# Altium project LimeSDR_1v2.PrjPcb (part 1 of 3)
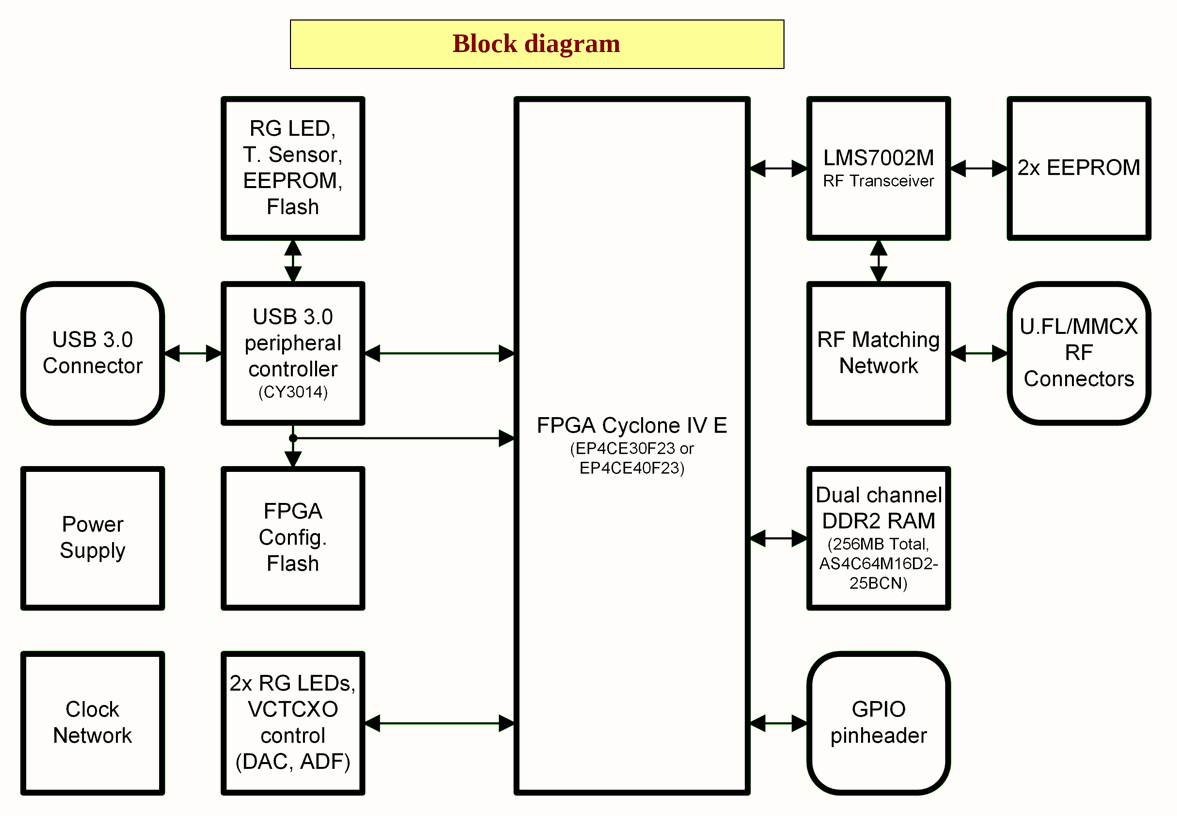
[diagram p0: 01_BlockDiagram.SchDoc]
8 sheets, 368 parts. Net scope: global (net labels, ports and power ports of the same name join across sheets).
Board file: LimeSDR_1v2.PcbDoc
Sheets:
  01_BlockDiagram.SchDoc
  02_PowerDiagram.SchDoc
  03_ClockDiagram.SchDoc
  05_LMS7002M_RF.SchDoc
  10_DDR2.SchDoc
  11_USB3_0_device.SchDoc
  12_USB3_0_power.SchDoc
  13_Clocks.SchDoc

## Sheet 01_BlockDiagram.SchDoc: Block diagram
size A4; Organization: Lime Microsystems; Address1: Surrey Tech Centre; Address2: Guildford GU2 7YG; Address3: Surrey; Address4: United Kingdom; Revision: v1.2; SheetNumber: 1; SheetTotal: 14

### Notes on the sheet
- Block diagram
- Project name:
- Title:
- Size:
- Date:
- A4
- Revision:
- Time:
- Sheet
- of
- File:

## Sheet 02_PowerDiagram.SchDoc: Power diagram
size A4; Organization: Lime Microsystems; Address1: Surrey Tech Centre; Address2: Guildford GU2 7YG; Address3: Surrey; Address4: United Kingdom; Revision: v1.2; SheetNumber: 2; SheetTotal: 14
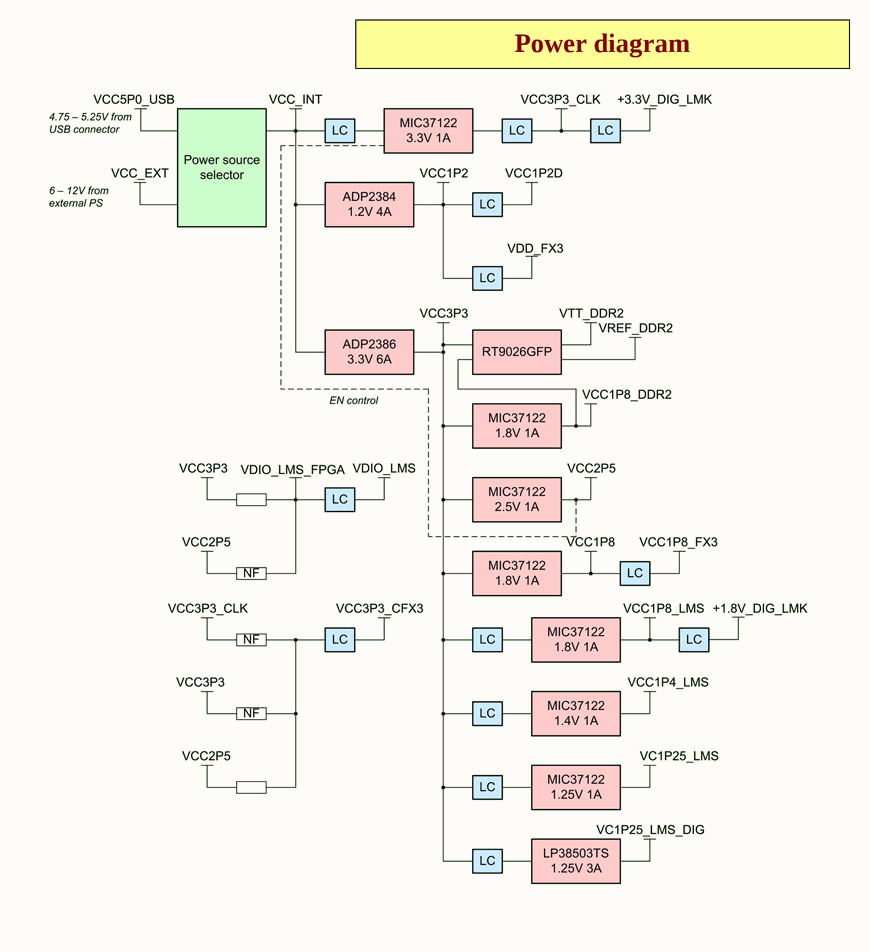
[diagram p1: 02_PowerDiagram.SchDoc]

### Notes on the sheet
- Power diagram
- Project name:
- Title:
- Size:
- Date:
- A4
- Revision:
- Time:
- Sheet
- of
- File:

## Sheet 03_ClockDiagram.SchDoc: Clock diagram
size A4; Organization: Lime Microsystems; Address1: Surrey Tech Centre; Address2: Guildford GU2 7YG; Address3: Surrey; Address4: United Kingdom; Revision: v1.2; SheetNumber: 3; SheetTotal: 14
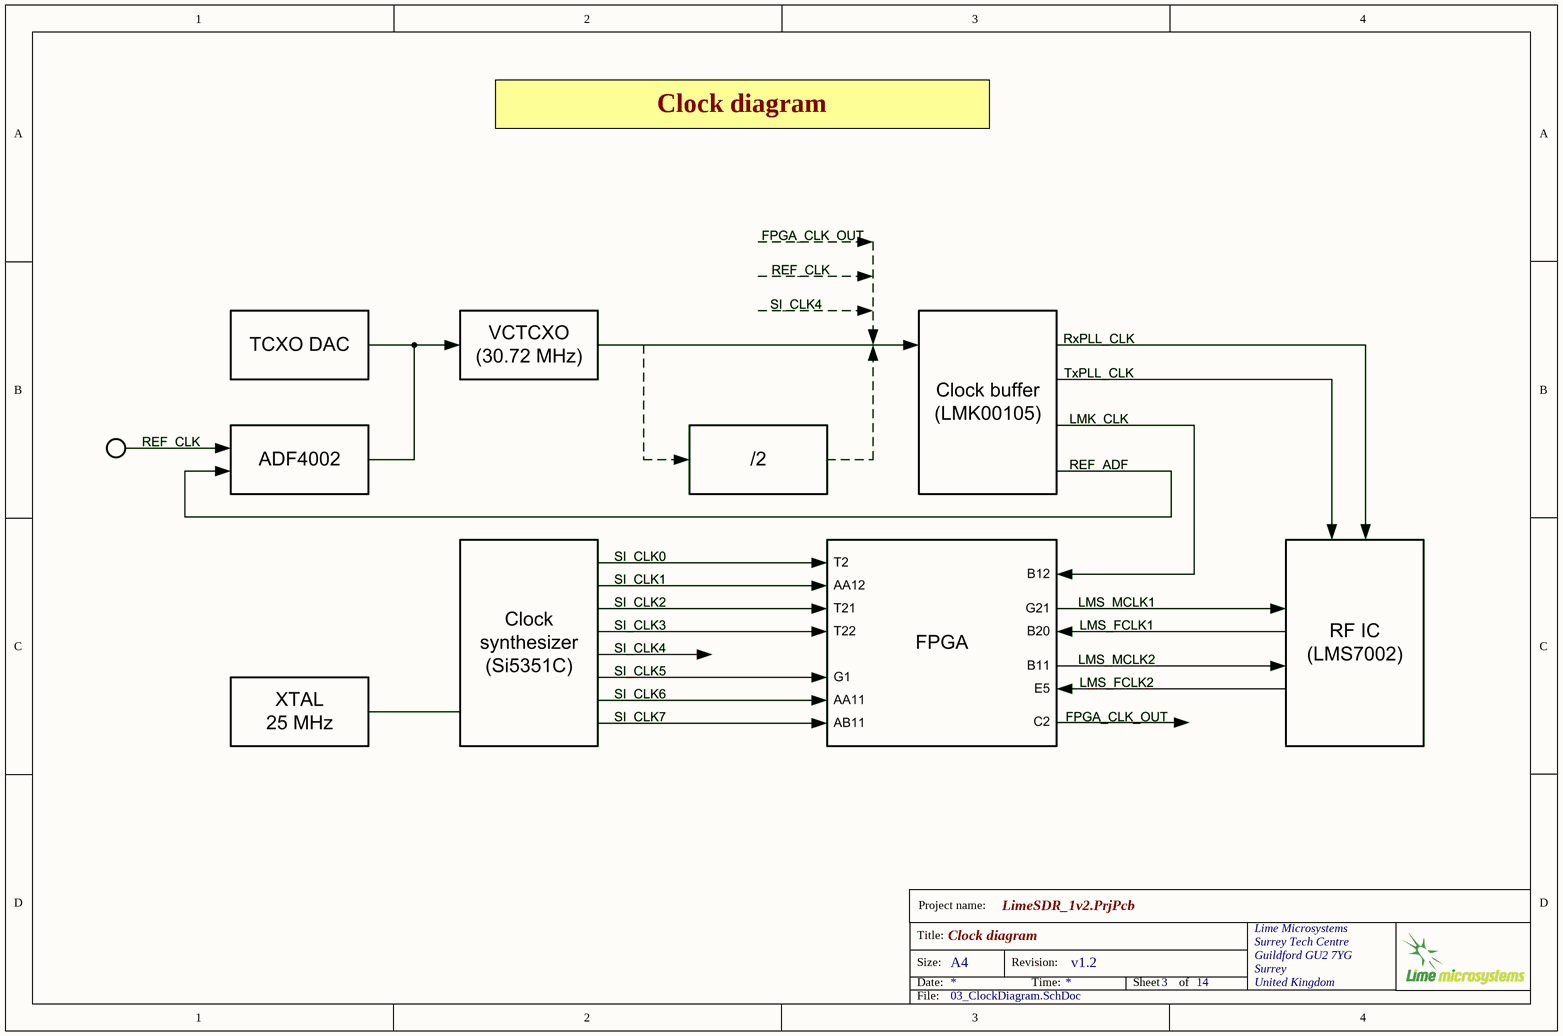
[diagram p2: 03_ClockDiagram.SchDoc]

### Notes on the sheet
- Clock diagram
- Project name:
- Title:
- Size:
- Date:
- A4
- Revision:
- Time:
- Sheet
- of
- File:

## Sheet 05_LMS7002M_RF.SchDoc: LMS7002M RF
size A3; Organization: Lime Microsystems; Address1: Surrey Tech Centre; Address2: Guildford GU2 7YG; Address3: Surrey; Address4: United Kingdom; Revision: v1.2; SheetNumber: 5; SheetTotal: 14
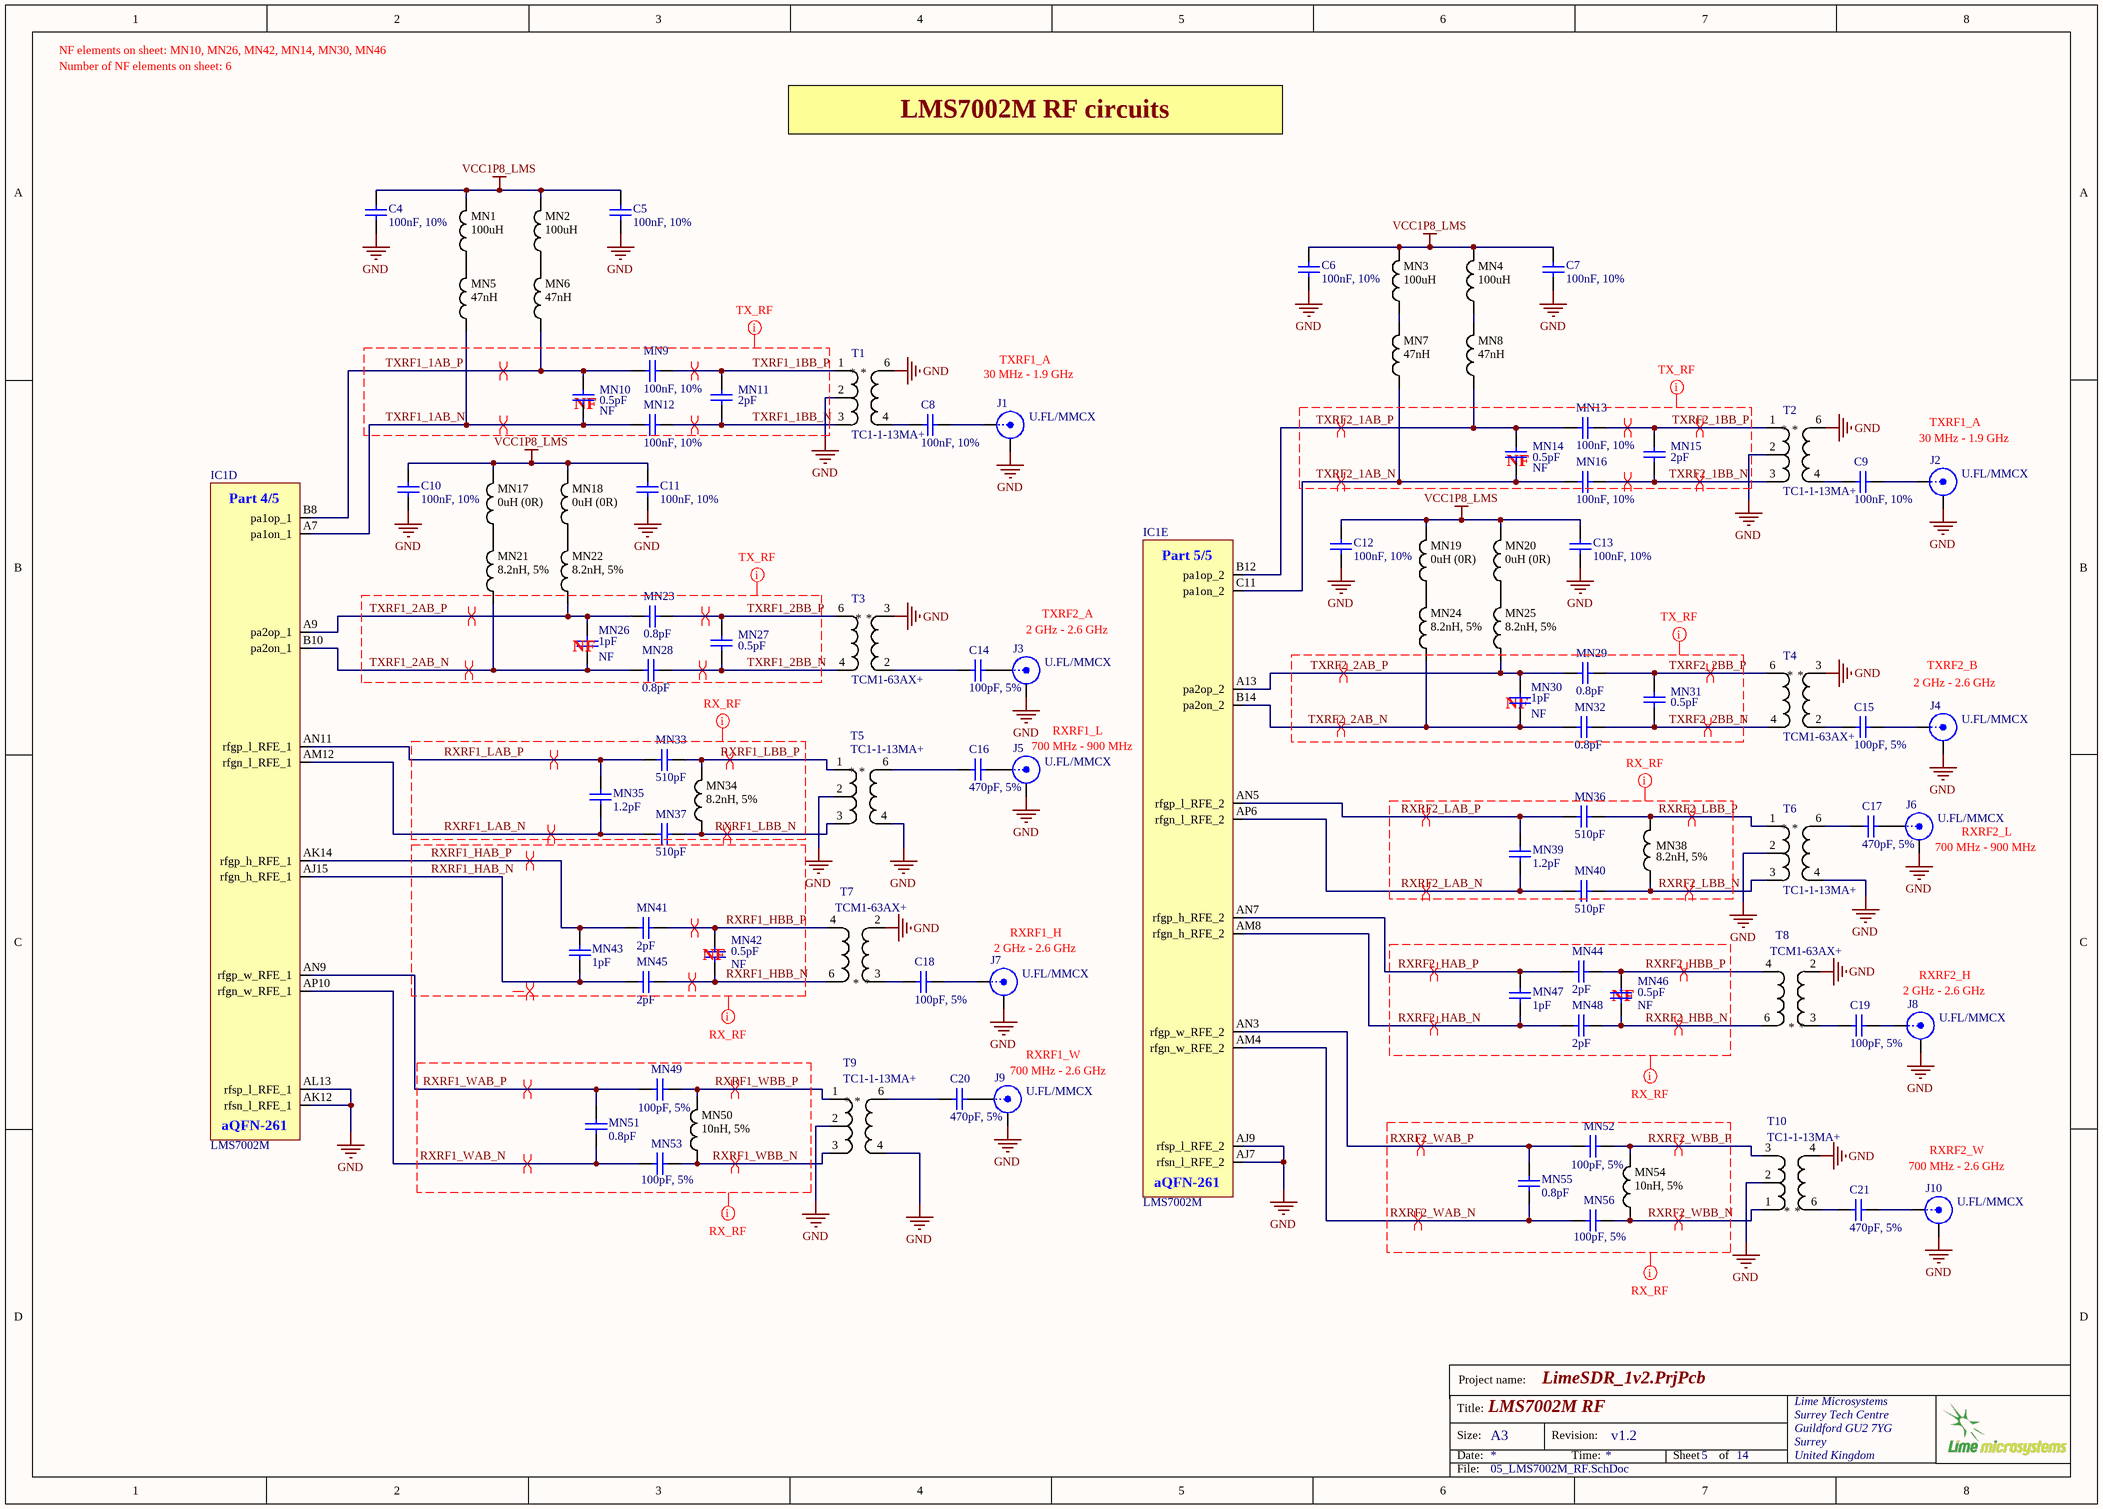
[diagram p3: 05_LMS7002M_RF.SchDoc]

### Parts
C4  100nF, 10%  [CAP0402]
C5  100nF, 10%  [CAP0402]
C6  100nF, 10%  [CAP0402]
C7  100nF, 10%  [CAP0402]
C8  100nF, 10%  [CAP0402]
C9  100nF, 10%  [CAP0402]
C10  100nF, 10%  [CAP0402]
C11  100nF, 10%  [CAP0402]
C12  100nF, 10%  [CAP0402]
C13  100nF, 10%  [CAP0402]
C14  100pF, 5%  [CAP0402]
C15  100pF, 5%  [CAP0402]
C16  470pF, 5%  [CAP0402]
C17  470pF, 5%  [CAP0402]
C18  100pF, 5%  [CAP0402]
C19  100pF, 5%  [CAP0402]
C20  470pF, 5%  [CAP0402]
C21  470pF, 5%  [CAP0402]
IC1  LMS7002M  [LMS7002M]  (parts D,E of 5)
J1  U.FL/MMCX  [MMCX_UFL_conn_u]
J2  U.FL/MMCX  [MMCX_UFL_conn_u]
J3  U.FL/MMCX  [MMCX_UFL_conn_u]
J4  U.FL/MMCX  [MMCX_UFL_conn_u]
J5  U.FL/MMCX  [MMCX_UFL_conn_u]
J6  U.FL/MMCX  [MMCX_UFL_conn_u]
J7  U.FL/MMCX  [MMCX_UFL_conn_u]
J8  U.FL/MMCX  [MMCX_UFL_conn_u]
J9  U.FL/MMCX  [MMCX_UFL_conn_u]
J10  U.FL/MMCX  [MMCX_UFL_conn_u]
MN1  100uH  [RES0805]
MN2  100uH  [RES0805]
MN3  100uH  [RES0805]
MN4  100uH  [RES0805]
MN5  47nH  [RES0402]
MN6  47nH  [RES0402]
MN7  47nH  [RES0402]
MN8  47nH  [RES0402]
MN9  100nF, 10%  [CAP0402]
MN10  0.5pF  Assembly Info: NF  [CAP0402]
MN11  2pF  [CAP0402]
MN12  100nF, 10%  [CAP0402]
MN13  100nF, 10%  [CAP0402]
MN14  0.5pF  Assembly Info: NF  [CAP0402]
MN15  2pF  [CAP0402]
MN16  100nF, 10%  [CAP0402]
MN17  0uH (0R)  [RES0805]
MN18  0uH (0R)  [RES0805]
MN19  0uH (0R)  [RES0805]
MN20  0uH (0R)  [RES0805]
MN21  8.2nH, 5%  [RES0402]
MN22  8.2nH, 5%  [RES0402]
MN23  0.8pF  [CAP0402]
MN24  8.2nH, 5%  [RES0402]
MN25  8.2nH, 5%  [RES0402]
MN26  1pF  Assembly Info: NF  [CAP0402]
MN27  0.5pF  [CAP0402]
MN28  0.8pF  [CAP0402]
MN29  0.8pF  [CAP0402]
MN30  1pF  Assembly Info: NF  [CAP0402]
MN31  0.5pF  [CAP0402]
MN32  0.8pF  [CAP0402]
MN33  510pF  [CAP0402]
MN34  8.2nH, 5%  [RES0402]
MN35  1.2pF  [CAP0402]
MN36  510pF  [CAP0402]
MN37  510pF  [CAP0402]
MN38  8.2nH, 5%  [RES0402]
MN39  1.2pF  [CAP0402]
MN40  510pF  [CAP0402]
MN41  2pF  [CAP0402]
MN42  0.5pF  Assembly Info: NF  [CAP0402]
MN43  1pF  [CAP0402]
MN44  2pF  [CAP0402]
MN45  2pF  [CAP0402]
MN46  0.5pF  Assembly Info: NF  [CAP0402]
MN47  1pF  [CAP0402]
MN48  2pF  [CAP0402]
MN49  100pF, 5%  [CAP0402]
MN50  10nH, 5%  [RES0402]
MN51  0.8pF  [CAP0402]
MN52  100pF, 5%  [CAP0402]
MN53  100pF, 5%  [CAP0402]
MN54  10nH, 5%  [RES0402]
MN55  0.8pF  [CAP0402]
MN56  100pF, 5%  [CAP0402]
T1  TC1-1-13MA+  [TC1-1-13MA+_v2]
T2  TC1-1-13MA+  [TC1-1-13MA+_v2]
T3  TCM1-63AX+  [TCM1-63AX+_v2]
T4  TCM1-63AX+  [TCM1-63AX+_v2]
T5  TC1-1-13MA+  [TC1-1-13MA+_v2]
T6  TC1-1-13MA+  [TC1-1-13MA+_v2]
T7  TCM1-63AX+  [TCM1-63AX+_v2]
T8  TCM1-63AX+  [TCM1-63AX+_v2]
T9  TC1-1-13MA+  [TC1-1-13MA+_v2]
T10  TC1-1-13MA+  [TC1-1-13MA+_v2]

### Nets
GND: C4.1 C5.1 C6.1 C7.1 C10.1 C11.1 C12.1 C13.1 IC1.AJ7(rfsn_l_RFE_2) IC1.AJ9(rfsp_l_RFE_2) IC1.AK12(rfsn_l_RFE_1) IC1.AL13(rfsp_l_RFE_1) J1.2(Y) J2.2(Y) J3.2(Y) J4.2(Y) J5.2(Y) J6.2(Y) J7.2(Y) J8.2(Y) J9.2(Y) J10.2(Y) T1.2 T1.6 T2.2 T2.6 T3.3 T4.3 T5.2 T5.4 T6.2 T6.4 T7.2 T8.2 T9.2 T9.4 T10.2 T10.4
VCC1P8_LMS: C4.2 C5.2 C6.2 C7.2 C10.2 C11.2 C12.2 C13.2 MN1.2 MN2.2 MN3.2 MN4.2 MN17.2 MN18.2 MN19.2 MN20.2
RXRF1_HAB_N: IC1.AJ15(rfgn_h_RFE_1) MN43.1 MN45.2
RXRF1_HAB_P: IC1.AK14(rfgp_h_RFE_1) MN41.2 MN43.2
RXRF1_HBB_N: MN42.1 MN45.1 T7.6
RXRF1_HBB_P: MN41.1 MN42.2 T7.4
RXRF1_LAB_N: IC1.AM12(rfgn_l_RFE_1) MN35.1 MN37.2
RXRF1_LAB_P: IC1.AN11(rfgp_l_RFE_1) MN33.2 MN35.2
RXRF1_LBB_N: MN34.1 MN37.1 T5.3
RXRF1_LBB_P: MN33.1 MN34.2 T5.1
RXRF1_WAB_N: IC1.AP10(rfgn_w_RFE_1) MN51.2 MN53.2
RXRF1_WAB_P: IC1.AN9(rfgp_w_RFE_1) MN49.2 MN51.1
RXRF1_WBB_N: MN50.1 MN53.1 T9.3
RXRF1_WBB_P: MN49.1 MN50.2 T9.1
RXRF2_HAB_N: IC1.AM8(rfgn_h_RFE_2) MN47.1 MN48.2
RXRF2_HAB_P: IC1.AN7(rfgp_h_RFE_2) MN44.2 MN47.2
RXRF2_HBB_N: MN46.1 MN48.1 T8.6
RXRF2_HBB_P: MN44.1 MN46.2 T8.4
RXRF2_LAB_N: IC1.AP6(rfgn_l_RFE_2) MN39.1 MN40.2
RXRF2_LAB_P: IC1.AN5(rfgp_l_RFE_2) MN36.2 MN39.2
RXRF2_LBB_N: MN38.1 MN40.1 T6.3
RXRF2_LBB_P: MN36.1 MN38.2 T6.1
RXRF2_WAB_N: IC1.AM4(rfgn_w_RFE_2) MN55.2 MN56.2
RXRF2_WAB_P: IC1.AN3(rfgp_w_RFE_2) MN52.2 MN55.1
RXRF2_WBB_N: MN54.1 MN56.1 T10.1
RXRF2_WBB_P: MN52.1 MN54.2 T10.3
TXRF1_1AB_N: IC1.A7(pa1on_1) MN5.1 MN10.1 MN12.1
TXRF1_1AB_P: IC1.B8(pa1op_1) MN6.1 MN9.2 MN10.2
TXRF1_1BB_N: MN11.1 MN12.2 T1.3
TXRF1_1BB_P: MN9.1 MN11.2 T1.1
TXRF1_2AB_N: IC1.B10(pa2on_1) MN21.1 MN26.2 MN28.2
TXRF1_2AB_P: IC1.A9(pa2op_1) MN22.1 MN23.2 MN26.1
TXRF1_2BB_N: MN27.1 MN28.1 T3.4
TXRF1_2BB_P: MN23.1 MN27.2 T3.6
TXRF2_1AB_N: IC1.C11(pa1on_2) MN7.1 MN14.1 MN16.1
TXRF2_1AB_P: IC1.B12(pa1op_2) MN8.1 MN13.2 MN14.2
TXRF2_1BB_N: MN15.1 MN16.2 T2.3
TXRF2_1BB_P: MN13.1 MN15.2 T2.1
TXRF2_2AB_N: IC1.B14(pa2on_2) MN24.1 MN30.2 MN32.2
TXRF2_2AB_P: IC1.A13(pa2op_2) MN25.1 MN29.2 MN30.1
TXRF2_2BB_N: MN31.1 MN32.1 T4.4
TXRF2_2BB_P: MN29.1 MN31.2 T4.6
NetC8_1: C8.1 J1.1(X)
NetC8_2: C8.2 T1.4
NetC9_1: C9.1 J2.1(X)
NetC9_2: C9.2 T2.4
NetC14_1: C14.1 J3.1(X)
NetC14_2: C14.2 T3.2
NetC15_1: C15.1 J4.1(X)
NetC15_2: C15.2 T4.2
NetC16_1: C16.1 J5.1(X)
NetC16_2: C16.2 T5.6
NetC17_1: C17.1 J6.1(X)
NetC17_2: C17.2 T6.6
NetC18_1: C18.1 J7.1(X)
NetC18_2: C18.2 T7.3
NetC19_1: C19.1 J8.1(X)
NetC19_2: C19.2 T8.3
NetC20_1: C20.1 J9.1(X)
NetC20_2: C20.2 T9.6
NetC21_1: C21.1 J10.1(X)
NetC21_2: C21.2 T10.6
NetMN1_1: MN1.1 MN5.2
NetMN2_1: MN2.1 MN6.2
NetMN3_1: MN3.1 MN7.2
NetMN4_1: MN4.1 MN8.2
NetMN17_1: MN17.1 MN21.2
NetMN18_1: MN18.1 MN22.2
NetMN19_1: MN19.1 MN24.2
NetMN20_1: MN20.1 MN25.2

### Layout directives
differential pair: RXRF1_HAB_N, RXRF1_HAB_P, RXRF1_HBB_N, RXRF1_HBB_P, RXRF1_LAB_N, RXRF1_LAB_P, RXRF1_LBB_N, RXRF1_LBB_P, RXRF1_WAB_N, RXRF1_WAB_P, RXRF1_WBB_N, RXRF1_WBB_P, RXRF2_HAB_N, RXRF2_HAB_P, RXRF2_HBB_N, RXRF2_HBB_P, RXRF2_LAB_N, RXRF2_LAB_P, RXRF2_LBB_N, RXRF2_LBB_P, RXRF2_WAB_N, RXRF2_WAB_P, RXRF2_WBB_N, RXRF2_WBB_P, TXRF1_1AB_N, TXRF1_1AB_P, TXRF1_1BB_N, TXRF1_1BB_P, TXRF1_2AB_N, TXRF1_2AB_P, TXRF1_2BB_N, TXRF1_2BB_P, TXRF2_1AB_N, TXRF2_1AB_P, TXRF2_1BB_N, TXRF2_1BB_P, TXRF2_2AB_N, TXRF2_2AB_P, TXRF2_2BB_N, TXRF2_2BB_P
net class TX_RF: TXRF1_1AB_N, TXRF1_1AB_P, TXRF1_1BB_N, TXRF1_1BB_P, TXRF1_2AB_N, TXRF1_2AB_P, TXRF1_2BB_N, TXRF1_2BB_P, TXRF2_1AB_N, TXRF2_1AB_P, TXRF2_1BB_N, TXRF2_1BB_P, TXRF2_2AB_N, TXRF2_2AB_P, TXRF2_2BB_N, TXRF2_2BB_P
net class RX_RF: RXRF1_HAB_N, RXRF1_HAB_P, RXRF1_HBB_N, RXRF1_HBB_P, RXRF1_LAB_N, RXRF1_LAB_P, RXRF1_LBB_N, RXRF1_LBB_P, RXRF1_WAB_N, RXRF1_WAB_P, RXRF1_WBB_N, RXRF1_WBB_P, RXRF2_HAB_N, RXRF2_HAB_P, RXRF2_HBB_N, RXRF2_HBB_P, RXRF2_LAB_N, RXRF2_LAB_P, RXRF2_LBB_N, RXRF2_LBB_P, RXRF2_WAB_N, RXRF2_WAB_P, RXRF2_WBB_N, RXRF2_WBB_P

### Notes on the sheet
- Number of NF elements on sheet: 6
- NF elements on sheet: MN10, MN26, MN42, MN14, MN30, MN46
- LMS7002M RF circuits
- 30 MHz - 1.9 GHz
- TXRF1_A
- (near MN10) NF
- (near J2) 30 MHz - 1.9 GHz
- (near MN14) NF
- (near MN26) NF
- 2 GHz - 2.6 GHz
- TXRF2_A
- (near MN30) NF
- TXRF2_B
- (near J5) 700 MHz - 900 MHz
- RXRF1_L
- (near J6) 700 MHz - 900 MHz
- (near J6) RXRF2_L
- (near MN42) NF
- (near J7) 2 GHz - 2.6 GHz
- (near J7) RXRF1_H
- RXRF2_H
- RXRF1_W
- (near MN46) NF
- (near J8) 2 GHz - 2.6 GHz
- (near J9) 700 MHz - 2.6 GHz
- 700 MHz - 2.6 GHz
- (near J10) RXRF2_W
- Project name:
- Title:
- Size:
- Date:
- A3
- Revision:
- Time:
- Sheet
- of
- File:
- (in symbol LMS7002M, part D) Part 4/5; aQFN-261
- (in symbol LMS7002M, part E) Part 5/5; aQFN-261

### Library data of the parts
C4-C13 = Cap_0402: Manufacturer: Murata Electronics; Manufacturer Part Number: GRM155R71C104KA88D; Part Description: 0.10µF ±10% 16V X7R Ceramic Capacitor -55°C ~ 125°C Surface Mount, MLCC 0402 (1005 Metric) 0.039" L x 0.020" W (1.00mm x 0.50mm); Voltage Rating DC: 16 V; Type: General Purpose MLCC; Capacitance: 0.1 uF; Case Length: 1 mm; Dielectric: X7R; Case Height: 0.5 mm; Temperature Coefficient / Code: +/- 15 %; Value: 100nF, 10%; Supplier 1: Mouser; Supplier Part Number 1: 81-GRM155R71C104KA88; Case Code - in: 0402; RoHS: RoHS Compliant; Operating Temperature Range: - 55 C to + 125 C; Series: GRM; Termination Style: SMD/SMT; Tolerance: 10 %; Package / Case: 0402 (1005 metric); Maximum Operating Temperature: + 125 C; Case Code - mm: 1005; Minimum Operating Temperature: - 55 C; Product Category: Low & Medium Capacitance SMD Ceramic Chip Capacitors; Packaging: Reel; Product: General Type MLCCs; Category: Multilayer Ceramic Capacitors MLCC - SMD/SMT; Brand: Murata Electronics; Case Width: 0.5 mm; RoHS - Mouser: Y; Standard Pack Qty: 10000; Minimum Order Quantity: 1; Reeling: True; Manufacturer Part Number 1: GRM155R71C104KA88D
C14 C15 C18 C19 MN49 MN52 MN53 MN56 = Cap_0402: Manufacturer Part Number 1: CC0402JRNPO9BN101; Manufacturer: Yageo; Part Description: 100pF ±5% 50V C0G, NP0 Ceramic Capacitor -55°C ~ 125°C Surface Mount, MLCC 0402 (1005 Metric) 0.039" L x 0.020" W (1.00mm x 0.50mm); Temperature Coefficient: C0G, NP0; Voltage - Rated: 50V; Value: 100pF, 5%; Capacitance: 100pF; Thickness (Max): 0.022" (0.55mm); Size / Dimension: 0.039" L x 0.020" W (1.00mm x 0.50mm); Tolerance: ±5%; RoHS: RoHS Compliant; Ratings: -; Package / Case: 0402 (1005 Metric); Mounting Type: Surface Mount, MLCC; Height - Seated (Max): -; Features: -; Lead Spacing: -; Operating Temperature: -55°C ~ 125°C; Packaging: Cut Tape (CT); Applications: General Purpose; Lead Style: -; Supplier 1: Digi-Key; Category: Capacitors; Supplier Part Number 1: 311-1024-1-ND
C16 C17 C20 C21 = Cap_0402: Manufacturer Part Number: C1005C0G1H471J050BA; Manufacturer: TDK Corporation; Part Description: 470pF ±5% 50V C0G, NP0 Ceramic Capacitor -55°C ~ 125°C Surface Mount, MLCC 0402 (1005 Metric) 0.039" L x 0.020" W (1.00mm x 0.50mm); Temperature Coefficient: C0G, NP0; Voltage - Rated: 50V; Value: 470pF, 5%; Supplier 1: Digi-Key; Supplier Part Number 1: 445-2656-6-ND; Ratings: -; Package / Case: 0402 (1005 Metric); Capacitance: 470pF; Packaging: Digi-Reel®; RoHS: RoHS Compliant; Tolerance: ±5%; Lead Style: -; Thickness (Max): 0.022" (0.55mm); Size / Dimension: 0.039" L x 0.020" W (1.00mm x 0.50mm); Lead Spacing: -; Operating Temperature: -55°C ~ 125°C; Height - Seated (Max): -; Applications: General Purpose; Mounting Type: Surface Mount, MLCC; Category: Capacitors; Features: -
IC1 = LMS7002M: Part Description: IC FPRF Transceiver LMS7002M; 261 pin aQFN; Manufacturer: Lime Microsystems; Manufacturer Part Number 1: LMS7002M; Supplier 1: Lime Microsystems; Supplier Part Number 1: LMS7002M
J1-J10 = RF_IF_connector: CONN UMC RCPT STR 50 OHM SMD; Manufacturer: Molex, LLC; Manufacturer Part Number 1: 0734120110; Body Finish: Nickel; Body Material: Phosphor Bronze; Center Contact Material: Brass; Center Contact Plating: Gold; Connector Style: Ultra Miniature Coaxial; Connector Type: Jack, Male Pin; Contact Termination: Solder; Dielectric Material: Liquid Crystal Polymer (LCP); Frequency - Max: 6GHz; Impedance: 50 Ohm; Voltage Rating: 60V; Cable Group: -; Category: Connectors, Interconnects; Fastening Type: Snap-On; Features: -; Housing Color: Silver; Ingress Protection: -; Mounting Type: Surface Mount; Operating Temperature: -40°C ~ 90°C; Packaging: Cut Tape (CT); RoHS: RoHS Compliant; Shield Termination: Solder; Supplier 1: Digi-Key; Supplier Part Number 1: WM5587CT-ND; Part Description: CONN UMC RCPT STR 50 OHM SMD
MN1-MN4 = Inductor_0603: Manufacturer: TDK Corporation; Manufacturer Part Number: MLF2012C101KT000; Part Description: FIXED IND 100UH 2MA 3.1 OHM SMD; Q @ Freq: 25 @ 1MHz; Shielding: Shielded; Current Rating: 2mA; Frequency - Self Resonant: 7MHz; Frequency - Test: 1MHz; Material - Core: Ferrite; Tolerance: ±10%; Inductance: 100µH; DC Resistance (DCR): 3.1 Ohm Max; Value: 100uH; Supplier 1: Digi-Key; Supplier Part Number 1: 445-1071-1-ND; Supplier Device Package: 0805 (2012 Metric); Size / Dimension: 0.079" L x 0.049" W (2.00mm x 1.25mm); Operating Temperature: -40°C ~ 85°C; Packaging: Cut Tape (CT); RoHS: RoHS Compliant; Current - Saturation: -; Height - Seated (Max): 0.057" (1.45mm); Package / Case: 0805 (2012 Metric); Mounting Type: Surface Mount; Type: Multilayer; Category: Inductors, Coils, Chokes
MN5-MN8 = Inductor_0603: Manufacturer: COILCRAFT; Manufacturer Part Number: 0402HP-47NXJLU; Part Description: INDUCTOR, RF, 47NH, 5%, 2.4GHZ, SMD; Product Range:0402HP Series; Inductance:47nH; Inductance Tolerance:± 5%; High Frequency Inductor Case:0402 [1005 Metric]; Self Resonant Frequency Min:2.4GHz; DC Resistance Max:0.58ohm; DC Current Rating:420mA; SVHC: No SVHC (15-Jun-2015); Inductance Tolerance: ± 5%; High Frequency Inductor Case: 0402 [1005 Metric]; Inductor Case Style: 0402 [1005 Metric]<!--FANDB--><div class="features-and-benefits-container"></div>; Inductance: 47; DC Resistance Max: 0.58; Self Resonant Frequency Min: 2.4; Product Range: 0402; DC Current Rating: 420; Inductor Construction: Wirewound; Supplier 1: Farnell; Supplier Part Number 1: 2285856; Packaging: Cut Tape; RoHS: Y-EX; value: 47nH
MN9 MN12 MN13 MN16 = Cap_0402: Manufacturer: Murata Electronics; Manufacturer Part Number: GRM155R71C104KA88D; Part Description: 0.10µF ±10% 16V X7R Ceramic Capacitor -55°C ~ 125°C Surface Mount, MLCC 0402 (1005 Metric) 0.039" L x 0.020" W (1.00mm x 0.50mm); Voltage Rating DC: 16 V; Capacitance: 0.1 uF; Case Length: 1 mm; Dielectric: X7R; Case Height: 0.5 mm; Temperature Coefficient / Code: +/- 15 %; Value: 100nF, 10%; Supplier 1: Mouser; Supplier Part Number 1: 81-GRM155R71C104KA88; Case Code - in: 0402; RoHS: RoHS Compliant; Operating Temperature Range: - 55 C to + 125 C; Series: GRM; Termination Style: SMD/SMT; Tolerance: 10 %; Package / Case: 0402 (1005 metric); Type: General Purpose MLCC; Maximum Operating Temperature: + 125 C; Case Code - mm: 1005; Minimum Operating Temperature: - 55 C; Product Category: Low & Medium Capacitance SMD Ceramic Chip Capacitors; Packaging: Reel; Product: General Type MLCCs; Category: Multilayer Ceramic Capacitors MLCC - SMD/SMT; Brand: Murata Electronics; Case Width: 0.5 mm; RoHS - Mouser: Y; Standard Pack Qty: 10000; Minimum Order Quantity: 1; Reeling: True; Manufacturer Part Number 1: GRM155R71C104KA88D
MN10 MN14 MN27 MN31 MN42 MN46 = Cap_0402: Manufacturer: Yageo; Manufacturer Part Number 1: CC0402CRNPO9BNR50; Part Description: 0.50pF ±0.25pF 50V C0G, NP0 Ceramic Capacitor -55°C ~ 125°C Surface Mount, MLCC 0402 (1005 Metric) 0.039" L x 0.020" W (1.00mm x 0.50mm); Capacitance: 0.50pF; Voltage - Rated: 50V; Temperature Coefficient: C0G, NP0; Tolerance: ±0.25pF; Value: 0.5pF; Supplier 1: Digi-Key; Supplier Part Number 1: 311-1001-1-ND; RoHS: RoHS Compliant; Thickness (Max): 0.022" (0.55mm); Features: -; Height - Seated (Max): -; Lead Spacing: -; Applications: General Purpose; Packaging: Cut Tape (CT); Ratings: -; Size / Dimension: 0.039" L x 0.020" W (1.00mm x 0.50mm); Lead Style: -; Mounting Type: Surface Mount, MLCC; Operating Temperature: -55°C ~ 125°C; Package / Case: 0402 (1005 Metric); Category: Capacitors
MN11 MN15 MN41 MN44 MN45 MN48 = Cap_0402: Manufacturer Part Number: 04025U2R0BAT2A; Manufacturer: AVX; Part Description: 2pF ±0.1pF 50V C0G, NP0 Ceramic Capacitor -55°C ~ 125°C Surface Mount, MLCC 0402 (1005 Metric) 0.039" L x 0.020" W (1.00mm x 0.50mm); Product Range: U Series; Voltage Rating: 50; SVHC: No SVHC (17-Dec-2014); Capacitance Tolerance: ± 0.1; Ceramic Capacitor Case: 0402 [1005 Metric]; Capacitance: 2; Dielectric Characteristic: C0G / NP0; Value: 2pF; Supplier 1: Farnell; Supplier Part Number 1: 2332536; Operating Temperature Max: 125; RoHS: YES; Operating Temperature Min: -55; Capacitance Tolerance ±: ± 0.1; Packaging: Cut Tape; MSL: MSL 1 - Unlimited
MN17-MN20 = Inductor_0603: Manufacturer: BOURNS; Manufacturer Part Number 1: CR0805-J/-000ELF; Part Description: RES SMD 0.0 OHM JUMPER 1/8W 0805; Value: 0uH (0R); Supplier 1: Farnell; Supplier Part Number 1: 2008388; RoHS: YES
MN21 MN22 MN24 MN25 MN34 MN38 = Inductor_0603: Manufacturer: COILCRAFT; Manufacturer Part Number 1: 0402HP-8N2XJLU; Part Description: INDUCTOR, RF, 8.2NH, 5%, 5.4GHZ, SMD; Product Range:0402HP Series; Inductance:8.2nH; Inductance Tolerance:± 5%; High Frequency Inductor Case:0402 [1005 Metric]; Self Resonant Frequency Min:5.4GHz; DC Resistance Max:0.065ohm; DC Current Rating:1.5A; Inductor Construction: Wirewound; DC Current Rating: 1.5; Inductor Case Style: 0402 [1005 Metric]<!--FANDB--><div class="features-and-benefits-container"></div>; Self Resonant Frequency Min: 5.4; DC Resistance Max: 0.065; High Frequency Inductor Case: 0402 [1005 Metric]; SVHC: No SVHC (16-Jun-2014); Inductance: 8.2; Supplier 1: Farnell; Supplier Part Number 1: 2285826; Packaging: Cut Tape; Product Range: COILCRAFT - 0402; Inductance Tolerance: ± 5%; RoHS: Y-EX; Value: 8.2nH, 5%
MN23 MN28 MN29 MN32 MN51 MN55 = Cap_0402: Manufacturer: Murata Electronics North America; Manufacturer Part Number: GRM1555C1HR80BA01D; Part Description: 0.80pF ±0.1pF 50V C0G, NP0 Ceramic Capacitor -55°C ~ 125°C Surface Mount, MLCC 0402 (1005 Metric) 0.039" L x 0.020" W (1.00mm x 0.50mm); Temperature Coefficient: C0G, NP0; Capacitance: 0.80pF; Voltage - Rated: 50V; Tolerance: ±0.1pF; Value: 0.8pF; Applications: General Purpose; Operating Temperature: -55°C ~ 125°C; Size / Dimension: 0.039" L x 0.020" W (1.00mm x 0.50mm); Features: -; Supplier 1: Digi-Key; Height - Seated (Max): -; Category: Capacitors; Package / Case: 0402 (1005 Metric); Mounting Type: Surface Mount, MLCC; Lead Spacing: -; Thickness (Max): 0.022" (0.55mm); RoHS: RoHS Compliant; Supplier Part Number 1: 490-6269-1-ND; Packaging: Cut Tape (CT); Ratings: -; Lead Style: -
MN26 MN30 MN43 MN47 = Cap_0402: Manufacturer: TDK Corporation; Manufacturer Part Number 1: C1005C0G1H010B050BA; Part Description: 1pF ±0.1pF 50V C0G, NP0 Ceramic Capacitor -55°C ~ 125°C Surface Mount, MLCC 0402 (1005 Metric) 0.039" L x 0.020" W (1.00mm x 0.50mm); Voltage - Rated: 50V; Temperature Coefficient: C0G, NP0; Tolerance: ±0.1pF; Value: 1pF; Supplier 1: Digi-Key; Supplier Part Number 1: 445-4854-6-ND; Size / Dimension: 0.039" L x 0.020" W (1.00mm x 0.50mm); Lead Spacing: -; Operating Temperature: -55°C ~ 125°C; Thickness (Max): 0.022" (0.55mm); Package / Case: 0402 (1005 Metric); Features: -; Lead Style: -; Applications: General Purpose; Height - Seated (Max): -; Capacitance: 1pF; RoHS: RoHS Compliant; Mounting Type: Surface Mount, MLCC; Packaging: Digi-Reel®; Ratings: -; Category: Capacitors
MN33 MN36 MN37 MN40 = Cap_0402: Manufacturer: Murata Electronics North America; Manufacturer Part Number: GRM1555C1H511JA01D; Part Description: 510pF ±5% 50V C0G, NP0 Ceramic Capacitor -55°C ~ 125°C Surface Mount, MLCC 0402 (1005 Metric) 0.039" L x 0.020" W (1.00mm x 0.50mm); Voltage - Rated: 50V; Temperature Coefficient: C0G, NP0; Tolerance: ±5%; Value: 510pF; Supplier 1: Digi-Key; Supplier Part Number 1: 490-3237-1-ND; Height - Seated (Max): -; Features: -; Size / Dimension: 0.039" L x 0.020" W (1.00mm x 0.50mm); Applications: General Purpose; Lead Spacing: -; Package / Case: 0402 (1005 Metric); Ratings: -; Thickness (Max): 0.022" (0.55mm); Lead Style: -; Operating Temperature: -55°C ~ 125°C; Mounting Type: Surface Mount, MLCC; Capacitance: 510pF; Category: Capacitors; RoHS: RoHS Compliant; Packaging: Cut Tape (CT)
MN35 MN39 = Cap_0402: Manufacturer: Murata Electronics North America; Manufacturer Part Number: GRM1555C1H1R2CA01D; Part Description: 1.2pF ±0.25pF 50V C0G, NP0 Ceramic Capacitor -55°C ~ 125°C Surface Mount, MLCC 0402 (1005 Metric) 0.039" L x 0.020" W (1.00mm x 0.50mm); Temperature Coefficient: C0G, NP0; Voltage - Rated: 50V; Tolerance: ±0.25pF; Value: 1.2pF; Supplier 1: Digi-Key; Supplier Part Number 1: 490-5927-1-ND; Lead Style: -; Category: Capacitors; Features: -; Packaging: Cut Tape (CT); Operating Temperature: -55°C ~ 125°C; Package / Case: 0402 (1005 Metric); Applications: General Purpose; Size / Dimension: 0.039" L x 0.020" W (1.00mm x 0.50mm); Lead Spacing: -; Ratings: -; Mounting Type: Surface Mount, MLCC; RoHS: RoHS Compliant; Height - Seated (Max): -; Thickness (Max): 0.022" (0.55mm); Capacitance: 1.2pF
MN50 MN54 = Inductor_0603: Manufacturer Part Number 1: 0402HP-10NXJLU; Manufacturer: COILCRAFT; Part Description: INDUCTOR, RF, 10NH, 5%, 4.7GHZ, SMD; Product Range:0402HP Series; Inductance:10nH; Inductance Tolerance:± 5%; High Frequency Inductor Case:0402 [1005 Metric]; Self Resonant Frequency Min:4.7GHz; DC Resistance Max:0.11ohm; DC Current Rating:1.3A; Value: 10nH, 5%; Supplier 1: Farnell; Supplier Part Number 1: 2285830; RoHS: Y-EX
T1 T2 T5 T6 T9 T10 = Balun: Manufacturer: Mini-Circuits; Part Description: RF balun, TC1-1-13MA+; Manufacturer Part Number 1: TC1-1-13MA+; Supplier Part Number 1: TC1-1-13MA+; Supplier 1: Minicircuits
T3 T4 T7 T8 = Balun_v2: Manufacturer: Mini-circuits; Part Description: RF balun, TCM1-63AX+; Supplier Part Number 1: TCM1-63AX+; Manufacturer Part Number 1: TCM1-63AX+; Supplier 1: Minicircuits

## Sheet 10_DDR2.SchDoc: RAM DDR2
size A3; Organization: Lime Microsystems; Address1: Surrey Tech Centre; Address2: Guildford GU2 7YG; Address3: Surray; Address4: United Kingdom; Revision: v1.2; SheetNumber: 10; SheetTotal: 14
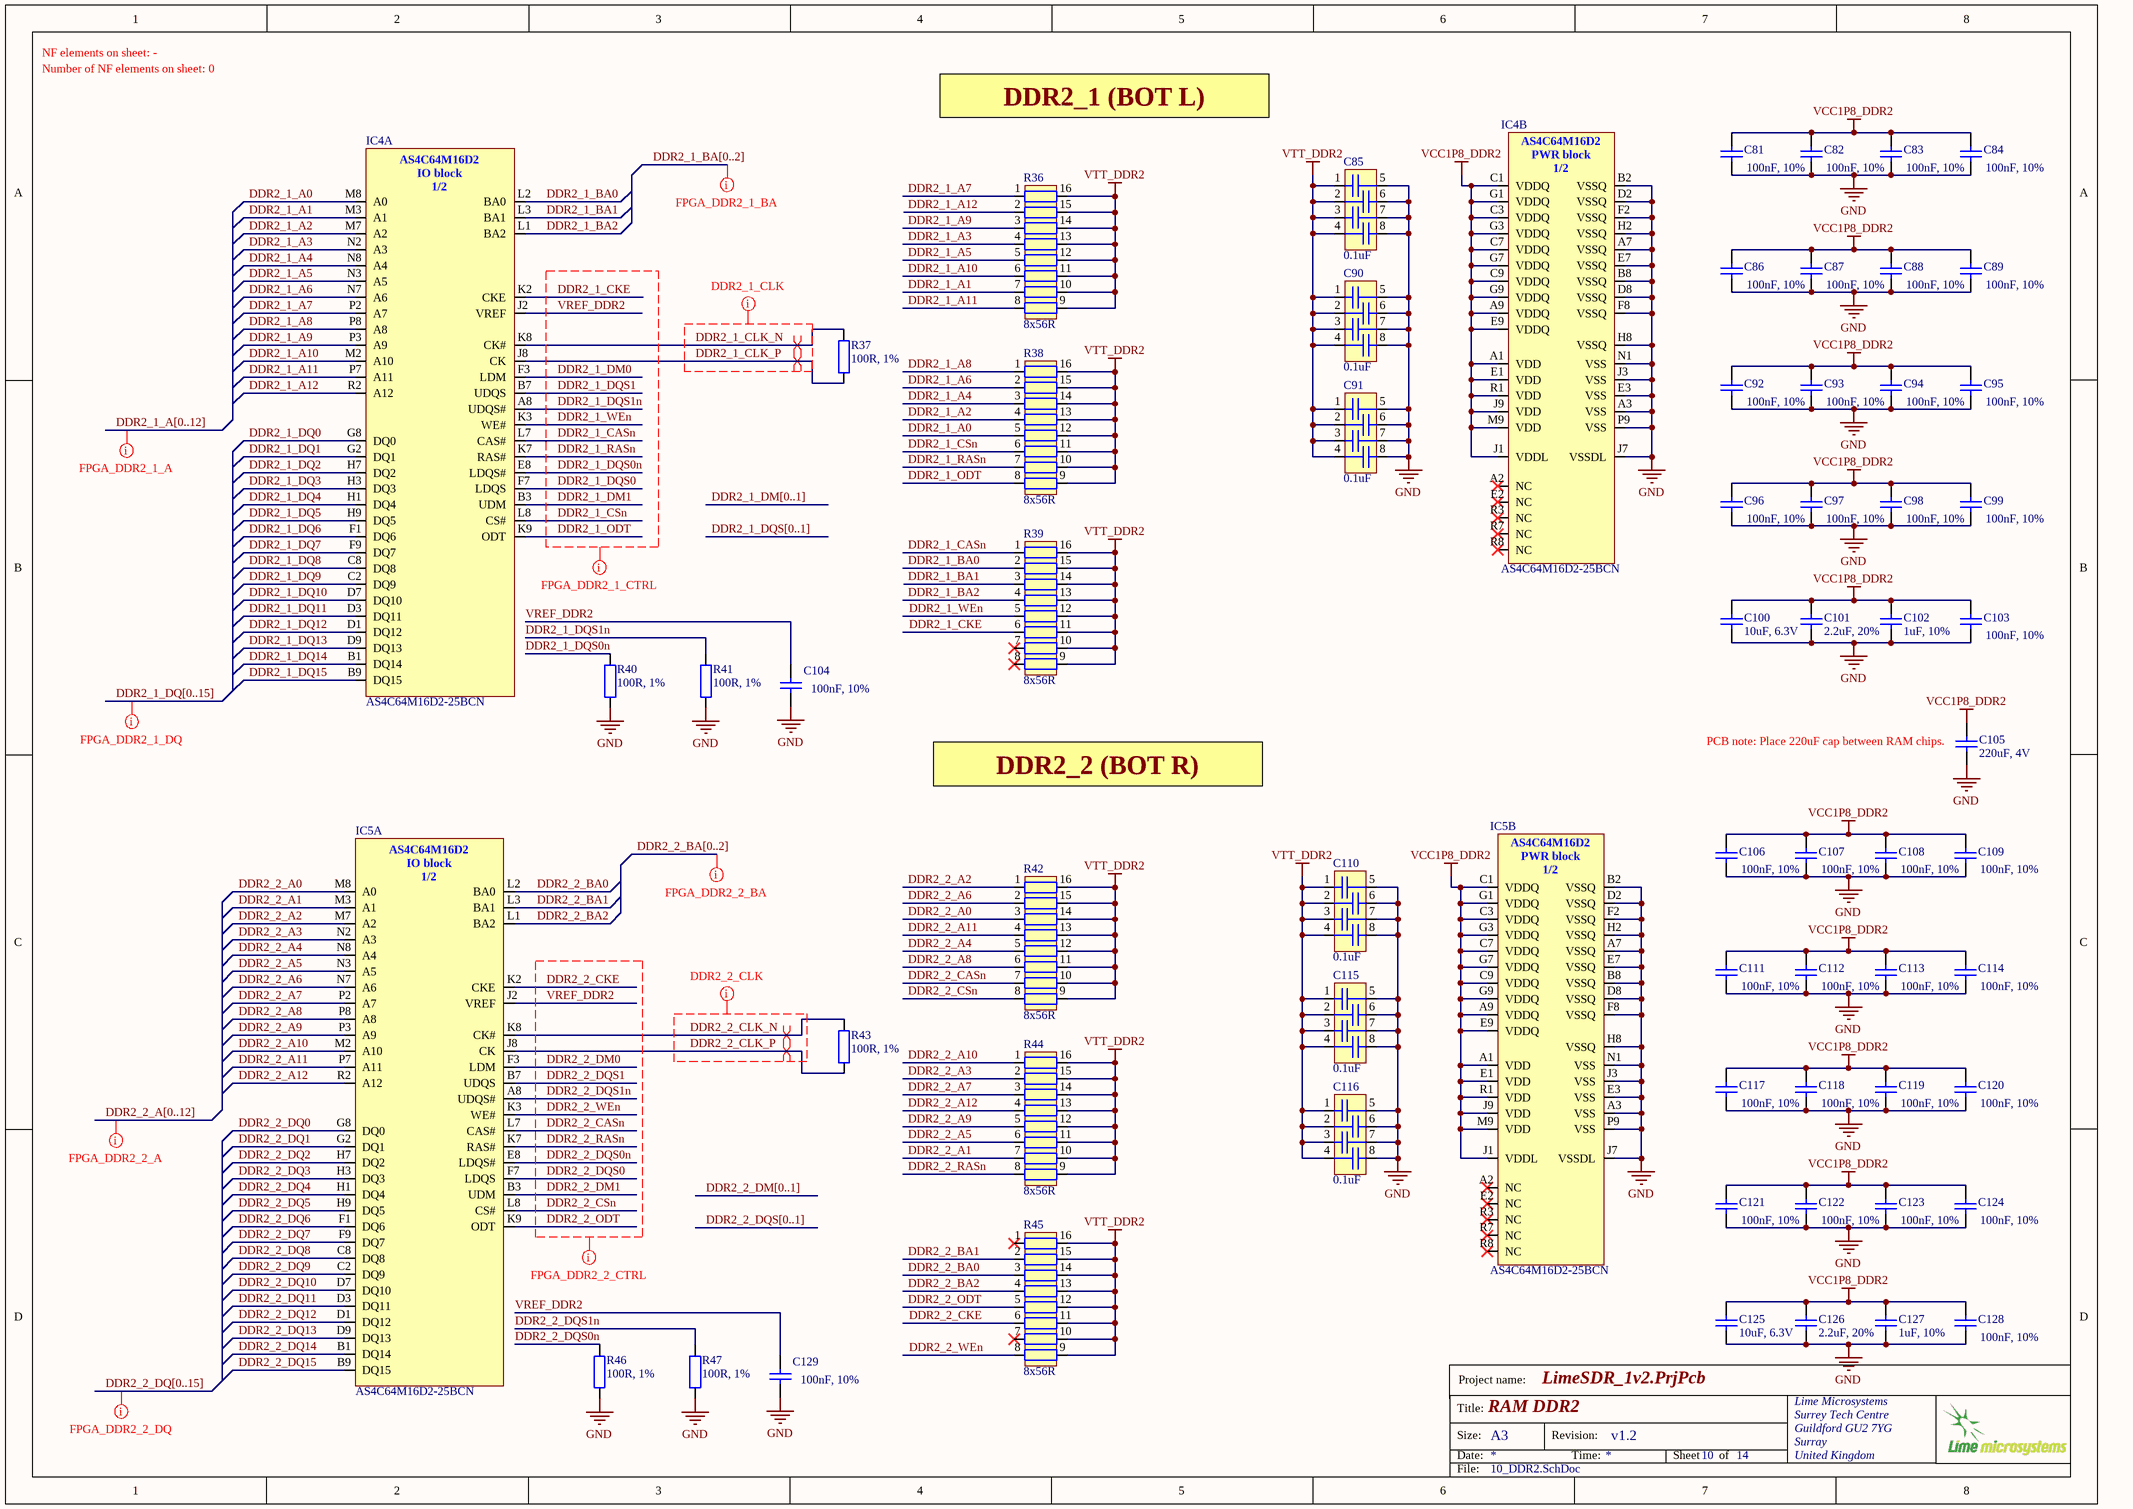
[diagram p4: 10_DDR2.SchDoc]

### Parts
C81  100nF, 10%  [CAP0402]
C82  100nF, 10%  [CAP0402]
C83  100nF, 10%  [CAP0402]
C84  100nF, 10%  [CAP0402]
C85  0.1uF  [CKCA43X7R1C104M100AA]
C86  100nF, 10%  [CAP0402]
C87  100nF, 10%  [CAP0402]
C88  100nF, 10%  [CAP0402]
C89  100nF, 10%  [CAP0402]
C90  0.1uF  [CKCA43X7R1C104M100AA]
C91  0.1uF  [CKCA43X7R1C104M100AA]
C92  100nF, 10%  [CAP0402]
C93  100nF, 10%  [CAP0402]
C94  100nF, 10%  [CAP0402]
C95  100nF, 10%  [CAP0402]
C96  100nF, 10%  [CAP0402]
C97  100nF, 10%  [CAP0402]
C98  100nF, 10%  [CAP0402]
C99  100nF, 10%  [CAP0402]
C100  10uF, 6.3V  [CAP0603]
C101  2.2uF, 20%  [CAP0402]
C102  1uF, 10%  [CAP0402]
C103  100nF, 10%  [CAP0402]
C104  100nF, 10%  [CAP0402]
C105  220uF, 4V  [CAP1206]
C106  100nF, 10%  [CAP0402]
C107  100nF, 10%  [CAP0402]
C108  100nF, 10%  [CAP0402]
C109  100nF, 10%  [CAP0402]
C110  0.1uF  [CKCA43X7R1C104M100AA]
C111  100nF, 10%  [CAP0402]
C112  100nF, 10%  [CAP0402]
C113  100nF, 10%  [CAP0402]
C114  100nF, 10%  [CAP0402]
C115  0.1uF  [CKCA43X7R1C104M100AA]
C116  0.1uF  [CKCA43X7R1C104M100AA]
C117  100nF, 10%  [CAP0402]
C118  100nF, 10%  [CAP0402]
C119  100nF, 10%  [CAP0402]
C120  100nF, 10%  [CAP0402]
C121  100nF, 10%  [CAP0402]
C122  100nF, 10%  [CAP0402]
C123  100nF, 10%  [CAP0402]
C124  100nF, 10%  [CAP0402]
C125  10uF, 6.3V  [CAP0603]
C126  2.2uF, 20%  [CAP0402]
C127  1uF, 10%  [CAP0402]
C128  100nF, 10%  [CAP0402]
C129  100nF, 10%  [CAP0402]
IC4  AS4C64M16D2-25BCN  [AS4C64M16D2]  (parts A,B of 2)
IC5  AS4C64M16D2-25BCN  [AS4C64M16D2]  (parts A,B of 2)
R36  8x56R  [EXB2HV]
R37  100R, 1%  [RES0402]
R38  8x56R  [EXB2HV]
R39  8x56R  [EXB2HV]
R40  100R, 1%  [RES0402]
R41  100R, 1%  [RES0402]
R42  8x56R  [EXB2HV]
R43  100R, 1%  [RES0402]
R44  8x56R  [EXB2HV]
R45  8x56R  [EXB2HV]
R46  100R, 1%  [RES0402]
R47  100R, 1%  [RES0402]

### Nets
GND: C81.2 C82.2 C83.2 C84.2 C85.5 C85.6 C85.7 C85.8 C86.2 C87.2 C88.2 C89.2 C90.5 C90.6 C90.7 C90.8 C91.5 C91.6 C91.7 C91.8 C92.2 C93.2 C94.2 C95.2 C96.2 C97.2 C98.2 C99.2 C100.1 C101.1 C102.1 C103.2 C104.2 C105.1 C106.2 C107.2 C108.2 C109.2 C110.5 C110.6 C110.7 C110.8 C111.2 C112.2 C113.2 C114.2 C115.5 C115.6 C115.7 C115.8 C116.5 C116.6 C116.7 C116.8 C117.2 C118.2 C119.2 C120.2 C121.2 C122.2 C123.2 C124.2 C125.1 C126.1 C127.1 C128.2 C129.2 IC4.A3(VSS) IC4.A7(VSSQ) IC4.B2(VSSQ) IC4.B8(VSSQ) IC4.D2(VSSQ) IC4.D8(VSSQ) IC4.E3(VSS) IC4.E7(VSSQ) IC4.F2(VSSQ) IC4.F8(VSSQ) IC4.H2(VSSQ) IC4.H8(VSSQ) IC4.J3(VSS) IC4.J7(VSSDL) IC4.N1(VSS) IC4.P9(VSS) IC5.A3(VSS) IC5.A7(VSSQ) IC5.B2(VSSQ) IC5.B8(VSSQ) IC5.D2(VSSQ) IC5.D8(VSSQ) IC5.E3(VSS) IC5.E7(VSSQ) IC5.F2(VSSQ) IC5.F8(VSSQ) IC5.H2(VSSQ) IC5.H8(VSSQ) IC5.J3(VSS) IC5.J7(VSSDL) IC5.N1(VSS) IC5.P9(VSS) R40.1 R41.1 R46.1 R47.1
VCC1P8_DDR2: C81.1 C82.1 C83.1 C84.1 C86.1 C87.1 C88.1 C89.1 C92.1 C93.1 C94.1 C95.1 C96.1 C97.1 C98.1 C99.1 C100.2 C101.2 C102.2 C103.1 C105.2 C106.1 C107.1 C108.1 C109.1 C111.1 C112.1 C113.1 C114.1 C117.1 C118.1 C119.1 C120.1 C121.1 C122.1 C123.1 C124.1 C125.2 C126.2 C127.2 C128.1 IC4.A1(VDD) IC4.A9(VDDQ) IC4.C1(VDDQ) IC4.C3(VDDQ) IC4.C7(VDDQ) IC4.C9(VDDQ) IC4.E1(VDD) IC4.E9(VDDQ) IC4.G1(VDDQ) IC4.G3(VDDQ) IC4.G7(VDDQ) IC4.G9(VDDQ) IC4.J1(VDDL) IC4.J9(VDD) IC4.M9(VDD) IC4.R1(VDD) IC5.A1(VDD) IC5.A9(VDDQ) IC5.C1(VDDQ) IC5.C3(VDDQ) IC5.C7(VDDQ) IC5.C9(VDDQ) IC5.E1(VDD) IC5.E9(VDDQ) IC5.G1(VDDQ) IC5.G3(VDDQ) IC5.G7(VDDQ) IC5.G9(VDDQ) IC5.J1(VDDL) IC5.J9(VDD) IC5.M9(VDD) IC5.R1(VDD)
VTT_DDR2: C85.1 C85.2 C85.3 C85.4 C90.1 C90.2 C90.3 C90.4 C91.1 C91.2 C91.3 C91.4 C110.1 C110.2 C110.3 C110.4 C115.1 C115.2 C115.3 C115.4 C116.1 C116.2 C116.3 C116.4 R36.9 R36.10 R36.11 R36.12 R36.13 R36.14 R36.15 R36.16 R38.9 R38.10 R38.11 R38.12 R38.13 R38.14 R38.15 R38.16 R39.9 R39.10 R39.11 R39.12 R39.13 R39.14 R39.15 R39.16 R42.9 R42.10 R42.11 R42.12 R42.13 R42.14 R42.15 R42.16 R44.9 R44.10 R44.11 R44.12 R44.13 R44.14 R44.15 R44.16 R45.9 R45.10 R45.11 R45.12 R45.13 R45.14 R45.15 R45.16
DDR2_1_A0: IC4.M8(A0) R38.5
DDR2_1_A1: IC4.M3(A1) R36.7
DDR2_1_A2: IC4.M7(A2) R38.4
DDR2_1_A3: IC4.N2(A3) R36.4
DDR2_1_A4: IC4.N8(A4) R38.3
DDR2_1_A5: IC4.N3(A5) R36.5
DDR2_1_A6: IC4.N7(A6) R38.2
DDR2_1_A7: IC4.P2(A7) R36.1
DDR2_1_A8: IC4.P8(A8) R38.1
DDR2_1_A9: IC4.P3(A9) R36.3
DDR2_1_A10: IC4.M2(A10) R36.6
DDR2_1_A11: IC4.P7(A11) R36.8
DDR2_1_A12: IC4.R2(A12) R36.2
DDR2_1_BA0: IC4.L2(BA0) R39.2
DDR2_1_BA1: IC4.L3(BA1) R39.3
DDR2_1_BA2: IC4.L1(BA2) R39.4
DDR2_1_CASn: IC4.L7(CAS#) R39.1
DDR2_1_CKE: IC4.K2(CKE) R39.6
DDR2_1_CLK_N: IC4.K8(CK#) R37.2
DDR2_1_CLK_P: IC4.J8(CK) R37.1
DDR2_1_CSn: IC4.L8(CS#) R38.6
DDR2_1_DM0: IC4.F3(LDM)
DDR2_1_DM1: IC4.B3(UDM)
DDR2_1_DQ0: IC4.G8(DQ0)
DDR2_1_DQ1: IC4.G2(DQ1)
DDR2_1_DQ2: IC4.H7(DQ2)
DDR2_1_DQ3: IC4.H3(DQ3)
DDR2_1_DQ4: IC4.H1(DQ4)
DDR2_1_DQ5: IC4.H9(DQ5)
DDR2_1_DQ6: IC4.F1(DQ6)
DDR2_1_DQ7: IC4.F9(DQ7)
DDR2_1_DQ8: IC4.C8(DQ8)
DDR2_1_DQ9: IC4.C2(DQ9)
DDR2_1_DQ10: IC4.D7(DQ10)
DDR2_1_DQ11: IC4.D3(DQ11)
DDR2_1_DQ12: IC4.D1(DQ12)
DDR2_1_DQ13: IC4.D9(DQ13)
DDR2_1_DQ14: IC4.B1(DQ14)
DDR2_1_DQ15: IC4.B9(DQ15)
DDR2_1_DQS0: IC4.F7(LDQS)
DDR2_1_DQS0n: IC4.E8(LDQS#) R40.2
DDR2_1_DQS1: IC4.B7(UDQS)
DDR2_1_DQS1n: IC4.A8(UDQS#) R41.2
DDR2_1_ODT: IC4.K9(ODT) R38.8
DDR2_1_RASn: IC4.K7(RAS#) R38.7
DDR2_1_WEn: IC4.K3(WE#) R39.5
DDR2_2_A0: IC5.M8(A0) R42.3
DDR2_2_A1: IC5.M3(A1) R44.7
DDR2_2_A2: IC5.M7(A2) R42.1
DDR2_2_A3: IC5.N2(A3) R44.2
DDR2_2_A4: IC5.N8(A4) R42.5
DDR2_2_A5: IC5.N3(A5) R44.6
DDR2_2_A6: IC5.N7(A6) R42.2
DDR2_2_A7: IC5.P2(A7) R44.3
DDR2_2_A8: IC5.P8(A8) R42.6
DDR2_2_A9: IC5.P3(A9) R44.5
DDR2_2_A10: IC5.M2(A10) R44.1
DDR2_2_A11: IC5.P7(A11) R42.4
DDR2_2_A12: IC5.R2(A12) R44.4
DDR2_2_BA0: IC5.L2(BA0) R45.3
DDR2_2_BA1: IC5.L3(BA1) R45.2
DDR2_2_BA2: IC5.L1(BA2) R45.4
DDR2_2_CASn: IC5.L7(CAS#) R42.7
DDR2_2_CKE: IC5.K2(CKE) R45.6
DDR2_2_CLK_N: IC5.K8(CK#) R43.2
DDR2_2_CLK_P: IC5.J8(CK) R43.1
DDR2_2_CSn: IC5.L8(CS#) R42.8
DDR2_2_DM0: IC5.F3(LDM)
DDR2_2_DM1: IC5.B3(UDM)
DDR2_2_DQ0: IC5.G8(DQ0)
DDR2_2_DQ1: IC5.G2(DQ1)
DDR2_2_DQ2: IC5.H7(DQ2)
DDR2_2_DQ3: IC5.H3(DQ3)
DDR2_2_DQ4: IC5.H1(DQ4)
DDR2_2_DQ5: IC5.H9(DQ5)
DDR2_2_DQ6: IC5.F1(DQ6)
DDR2_2_DQ7: IC5.F9(DQ7)
DDR2_2_DQ8: IC5.C8(DQ8)
DDR2_2_DQ9: IC5.C2(DQ9)
DDR2_2_DQ10: IC5.D7(DQ10)
DDR2_2_DQ11: IC5.D3(DQ11)
DDR2_2_DQ12: IC5.D1(DQ12)
DDR2_2_DQ13: IC5.D9(DQ13)
DDR2_2_DQ14: IC5.B1(DQ14)
DDR2_2_DQ15: IC5.B9(DQ15)
DDR2_2_DQS0: IC5.F7(LDQS)
DDR2_2_DQS0n: IC5.E8(LDQS#) R46.2
DDR2_2_DQS1: IC5.B7(UDQS)
DDR2_2_DQS1n: IC5.A8(UDQS#) R47.2
DDR2_2_ODT: IC5.K9(ODT) R45.5
DDR2_2_RASn: IC5.K7(RAS#) R44.8
DDR2_2_WEn: IC5.K3(WE#) R45.8
VREF_DDR2: C104.1 C129.1 IC4.J2(VREF) IC5.J2(VREF)

Not connected (* = marked no-connect by the designer): IC4 A2(NC)* E2(NC)* R3(NC)* R7(NC)* R8(NC)*; IC5 A2(NC)* E2(NC)* R3(NC)* R7(NC)* R8(NC)*; R39 7* 8*; R45 1* 7*

### Buses and harness runs
bus DDR2_1_A[0..12]
bus DDR2_1_BA[0..2]
bus DDR2_1_DM[0..1]
bus DDR2_1_DQ[0..15]
bus DDR2_1_DQS[0..1]
bus DDR2_2_A[0..12]
bus DDR2_2_BA[0..2]
bus DDR2_2_DM[0..1]
bus DDR2_2_DQ[0..15]
bus DDR2_2_DQS[0..1]

### Layout directives
net class FPGA_DDR0_DQ: (no net found under the mark)
net class FPGA_DDR0_BA: (no net found under the mark)
net class FPGA_DDR0_CTRL: DDR2_1_CASn, DDR2_1_CKE, DDR2_1_CSn, DDR2_1_DM0, DDR2_1_DM1, DDR2_1_DQS0, DDR2_1_DQS0n, DDR2_1_DQS1, DDR2_1_DQS1n, DDR2_1_ODT, DDR2_1_RASn, DDR2_1_WEn, VREF_DDR2
net class FPGA_DDR0_A: (no net found under the mark)
net class FPGA_DDR1_DQ: (no net found under the mark)
net class FPGA_DDR1_BA: (no net found under the mark)
net class FPGA_DDR1_CTRL: DDR2_2_CASn, DDR2_2_CKE, DDR2_2_CSn, DDR2_2_DM0, DDR2_2_DM1, DDR2_2_DQS0, DDR2_2_DQS0n, DDR2_2_DQS1, DDR2_2_DQS1n, DDR2_2_ODT, DDR2_2_RASn, DDR2_2_WEn, VREF_DDR2
net class FPGA_DDR1_A: (no net found under the mark)
differential pair: DDR2_1_CLK_N, DDR2_1_CLK_P, DDR2_2_CLK_N, DDR2_2_CLK_P
net class DDR2_1_CK: DDR2_1_CLK_N, DDR2_1_CLK_P, DDR2_2_CLK_N, DDR2_2_CLK_P

### Notes on the sheet
- Number of NF elements on sheet: 0
- NF elements on sheet: -
- DDR2_1 (BOT L)
- DDR2_2 (BOT R)
- (near C105) PCB note: Place 220uF cap between RAM chips.
- Project name:
- Title:
- Size:
- Date:
- A3
- Revision:
- Time:
- Sheet
- of
- File:
- (in symbol AS4C64M16D2-25BCN, part A) AS4C64M16D2 / IO block / 1/2
- (in symbol AS4C64M16D2-25BCN, part B) AS4C64M16D2 / PWR block / 1/2

### Library data of the parts
C81-C84 C86-C89 C92-C99 C103 C104 C106-C109 C111-C114 C117-C124 C128 C129 = Cap_0603: Manufacturer Part Number 1: GRM155R71C104KA88D; Part Description: 0.10µF ±10% 16V X7R Ceramic Capacitor -55°C ~ 125°C Surface Mount, MLCC 0402 (1005 Metric) 0.039" L x 0.020" W (1.00mm x 0.50mm); Brand: Murata Electronics; Type: General Purpose MLCC; Capacitance: 0.1 uF; Temperature Coefficient / Code: +/- 15 %; Voltage Rating DC: 16 V; Supplier 1: Mouser; Supplier Part Number 1: 81-GRM155R71C104KA88; Tolerance: 10 %; Case Code - in: 0402; Manufacturer: Murata Electronics; Category: Multilayer Ceramic Capacitors MLCC - SMD/SMT; Value: 100nF, 10%; Manufacturer Part Number: GRM155R71C104KA88D
C85 C90 C91 C110 C115 C116 = 4X_cap_array_1206: Manufacturer: TDK; Part Description: CAP ARRAY 0.1UF 16V X7R 1206; Case Height: 1 mm; Case Length: 3.2 mm; Case Width: 1.6 mm; Voltage Rating: 16 V; Number of Elements: 4; Tolerance: 20 %; Temperature Coefficient / Code: X7R; Value: 0.1uF; Supplier 1: Mouser; Supplier Part Number 1: 810-CKCA43X7R1C104M; RoHS: RoHS Compliant; Termination Style: SMD/SMT; Brand: TDK; Category: Capacitor Arrays & Networks; Product: Ceramic Capacitor Arrays; Series: CKC; Packaging: Reel; Operating Temperature Range: - 55 C to + 125 C; Manufacturer Part Number 1: CKCA43X7R1C104M100AA; Capacitance: 0.1 uF; Product Category: Capacitor Arrays; Standard Pack Qty: 2000; RoHS - Mouser: Y; Minimum Order Quantity: 1; Reeling: True
C100 C125 = Cap_0603: Manufacturer Part Number 1: CC0603MRX5R5BB106; Part Description: 10µF ±20% 6.3V X5R Ceramic Capacitor -55°C ~ 85°C Surface Mount, MLCC 0603 (1608 Metric) 0.063" L x 0.031" W (1.60mm x 0.80mm); Manufacturer: Yageo; Capacitance: 10µF; Tolerance: ±20%; Supplier 1: Digi-Key; Supplier Part Number 1: 311-1448-2-ND; Package / Case: 0603 (1608 Metric); Category: Capacitors; Voltage - Rated: 6.3V; Value: 10uF, 6.3V
C101 C126 = Cap_0402: Manufacturer Part Number 1: C1005X5R1C225K050BC; Manufacturer: TDK Corporation; Part Description: 2.2µF ±10% 16V X5R Ceramic Capacitor -55°C ~ 85°C Surface Mount, MLCC 0402 (1005 Metric) 0.039" L x 0.020" W (1.00mm x 0.50mm); Voltage - Rated: 16V; Temperature Coefficient: X5R; Capacitance: 2.2µF; Value: 2.2uF, 20%; Supplier 1: Digi-Key; Supplier Part Number 1: 445-9085-1-ND; Category: Capacitors; Thickness (Max): 0.022" (0.55mm); Applications: General Purpose; Package / Case: 0402 (1005 Metric); Size / Dimension: 0.039" L x 0.020" W (1.00mm x 0.50mm); Features: -; Mounting Type: Surface Mount, MLCC; Ratings: -; Lead Style: -; Operating Temperature: -55°C ~ 85°C; Lead Spacing: -; RoHS: RoHS Compliant; Height - Seated (Max): -; Tolerance: ±20%; Packaging: Tape & Reel (TR)
C102 C127 = Cap_0402: Manufacturer Part Number 1: GRM155R61A105KE15J; Manufacturer: TDK; Part Description: 1µF ±10% 10V X5R Ceramic Capacitor -55°C ~ 85°C Surface Mount, MLCC 0402 (1005 Metric) 0.039" L x 0.020" W (1.00mm x 0.50mm); Voltage Rating: 10; Product Range: TDK - C Series; Ceramic Capacitor Case: 0402 [1005 Metric]; Capacitance: 1; Dielectric Characteristic: X6; Value: 1uF, 10%; Supplier 1: Newark; Supplier Part Number 1: 490-6298-2-ND; Capacitance Tolerance: ± 10%; MSL: -; RoHS: YES
C105 = Cap_1206: Manufacturer Part Number: GRM31CR60G227ME11L; Manufacturer: Murata Electronics North America; Part Description: 220µF ±20% 4V X5R Ceramic Capacitor -55°C ~ 85°C Surface Mount, MLCC 1206 (3216 Metric) 0.126" L x 0.063" W (3.20mm x 1.60mm); Capacitance: 220µF; Temperature Coefficient: X5R; Tolerance: ±20%; Package / Case: 1206 (3216 Metric); Supplier 1: Digi-Key; Packaging: Cut Tape (CT); Size / Dimension: 0.126" L x 0.063" W (3.20mm x 1.60mm); Operating Temperature: -55°C ~ 85°C; Voltage - Rated: 4V; Mounting Type: Surface Mount, MLCC; Ratings: -; Supplier Part Number 1: 490-9774-1-ND; Category: Capacitors; Lead Spacing: -; Lead Style: -; Applications: General Purpose; Features: -; Height - Seated (Max): -; Thickness (Max): 0.075" (1.90mm); RoHS: RoHS Compliant; Value: 220uF, 4V
IC4 IC5 = AS4C64M16D2-25BCN: Manufacturer: Alliance Memory, Inc.; Part Description: IC SDRAM 64MX16 1.8V 84-FBGA; Speed: 400MHz; Interface: Parallel; Memory Type: DDR2 SDRAM; Memory Size: 1G (64M x 16); Voltage - Supply: 1.7 V ~ 1.9 V; Format - Memory: RAM; Supplier 1: Digi-Key; Package / Case: 84-TFBGA; Supplier Device Package: 84-FBGA (8x12.5); Manufacturer Part Number 1: AS4C64M16D2-25BCN; RoHS: RoHS Compliant; Operating Temperature: 0°C ~ 70°C; Category: Integrated Circuits (ICs); Packaging: Tray; Supplier Part Number 1: 1450-1158-ND
R36 R38 R39 R42 R44 R45 = 8X_resistor_array_0402: Manufacturer Part Number 1: EXB2HV560JV; Manufacturer: PANASONIC ELECTRONIC COMPONENTS; Part Description: RES ARRAY 8 RES 56 OHM 1506; Supplier 1: Farnell; Supplier Part Number 1: 2060070; RoHS: YES
R37 R40 R41 R43 R46 R47 = Res_0402: Manufacturer Part Number 1: RMCF0402FT100R; Part Description: RES SMD 100 OHM 1% 1/16W 0402; Temperature Coefficient: ±100ppm/°C; Supplier 1: Digi-Key; Supplier Part Number 1: RMCF0402FT100RDKR-ND; Package / Case: 0402 (1005 Metric); Composition: Thick Film; Category: Resistors; Tolerance: ±1%; Value: 100R, 1%